# EAGLE schematic batteryless_design_revA (EAGLE 8.5.0)

## Sheet 1 of 2
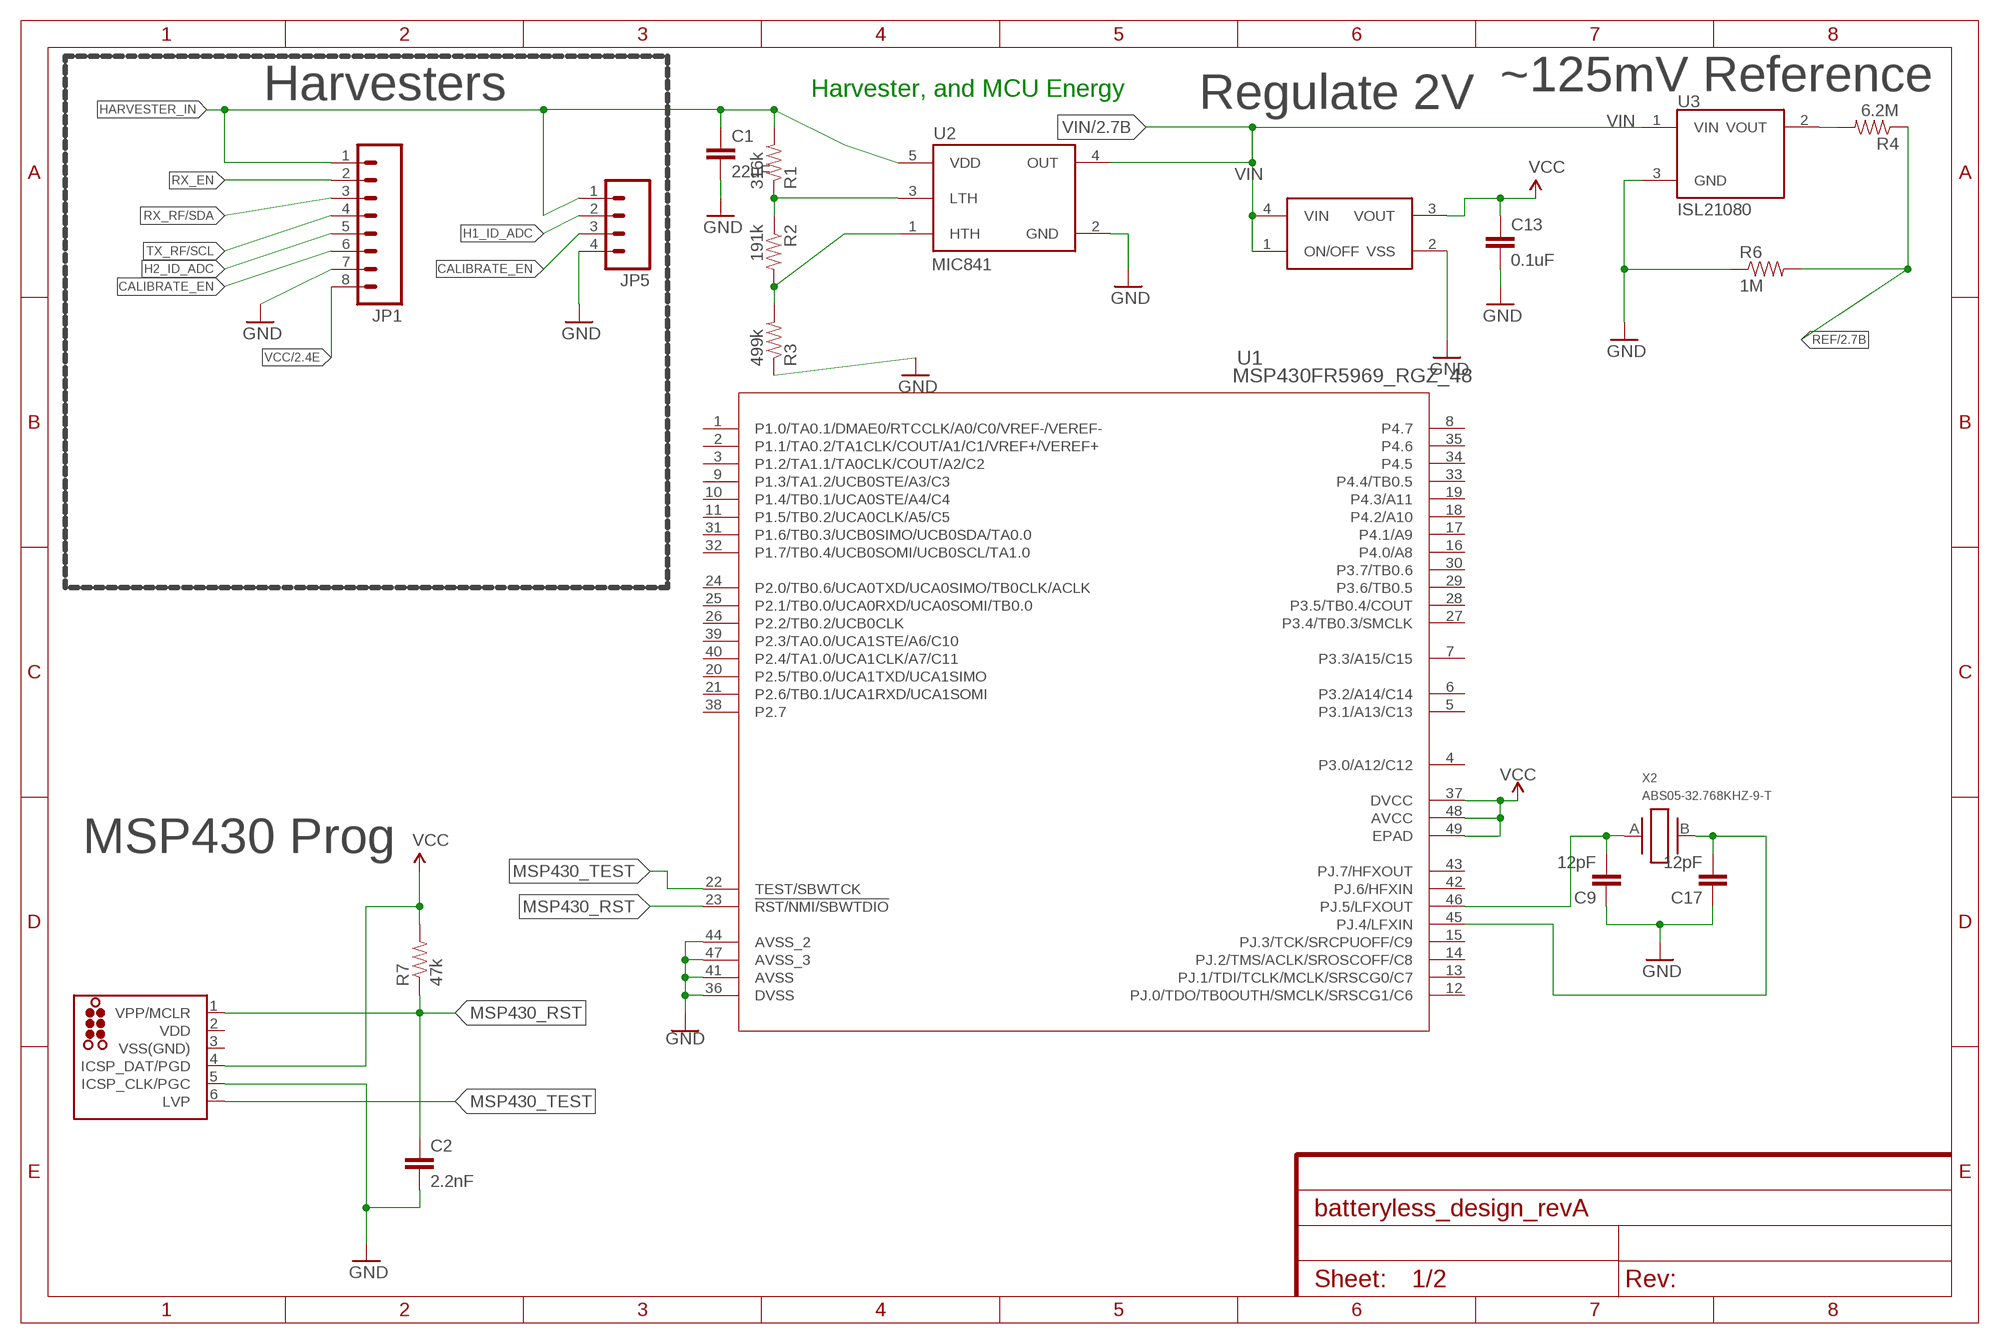
[diagram p0: schematic, sheet 1]

### Parts
C1  22uF  CAP1210  [1210]
C2  2.2nF  C-EU0603  [0603]
C9  12pF  C-EU0603  [0603]
C13  0.1uF  C-EU0603  [0603]
C17  12pF  C-EU0603  [0603]
J1  TC2030-MCP-NL  [TC2030-MCP-NL]
JP1  M081.27MM  [1X08-1.27MM]
JP5  M041.27MM  [1X04-1.27MM]
R1  316k  R-EU0603  [0603]
R2  191k  R-EU0603  [0603]
R3  499k  R-EU0603  [0603]
R4  6.2M  R-EU0603  [0603]
R6  1M  R-EU0603  [0603]
R7  47k  R-EU0603  [0603]
U1  MSP430FR5969_RGZ_48  [RGZ48_4P1X4P1]
U2  MIC841  [SC70-5]
U3  ISL21080  [SOT-23]
U$6  S-1313  [SC82-AB_1PRIMARY]
X2  ABS05-32.768KHZ-9-T  [ABS05]

### Nets
CALIBRATE_EN: JP1.6 JP5.3
GND: C1.2 C2.2 C9.1 C13.2 C17.1 J1.5(ICSP_CLK/PGC) JP1.7 JP5.4 R3.1 R6.1 U1.36(DVSS) U1.41(AVSS) U1.44(AVSS_2) U1.47(AVSS_3) U2.2(GND) U3.3(GND) U$6.2(VSS) ; also sheet 2
H1_ID_ADC: JP5.2
H2_ID_ADC: JP1.5
HARVESTER_IN: C1.1 JP1.1 JP5.1 R1.2 U2.5(VDD)
MSP430_RST: C2.1 J1.1(VPP/MCLR) R7.1
MSP430_TEST: J1.6(LVP)
N$1: U1.22(TEST/SBWTCK)
N$2: U1.23(!RST/NMI/SBWTDIO)
N$3: C17.2 U1.45(PJ.4/LFXIN) X2.B
N$4: C9.2 U1.46(PJ.5/LFXOUT) X2.A
N$5: R1.1 R2.1 U2.3(LTH)
N$6: R2.2 R3.2 U2.1(HTH)
N$7: R4.2 U3.2(VOUT)
REF: R4.1 R6.2 ; also sheet 2
RX_EN: JP1.2
RX_RF/SDA: JP1.3
TX_RF/SCL: JP1.4
VCC: C13.1 J1.4(ICSP_DAT/PGD) JP1.8 R7.2 U1.37(DVCC) U1.48(AVCC) U1.49(EPAD) U$6.3(VOUT) ; also sheet 2
VIN: U2.4(OUT) U3.1(VIN) U$6.1(ON/OFF) U$6.4(VIN) ; also sheet 2
Unconnected: U1.1(P1.0/TA0.1/DMAE0/RTCCLK/A0/C0/VREF-/VEREF-) U1.2(P1.1/TA0.2/TA1CLK/COUT/A1/C1/VREF+/VEREF+) U1.3(P1.2/TA1.1/TA0CLK/COUT/A2/C2) U1.4(P3.0/A12/C12) U1.5(P3.1/A13/C13) U1.6(P3.2/A14/C14) U1.7(P3.3/A15/C15) U1.8(P4.7) U1.9(P1.3/TA1.2/UCB0STE/A3/C3) U1.10(P1.4/TB0.1/UCA0STE/A4/C4) U1.11(P1.5/TB0.2/UCA0CLK/A5/C5) U1.12(PJ.0/TDO/TB0OUTH/SMCLK/SRSCG1/C6) U1.13(PJ.1/TDI/TCLK/MCLK/SRSCG0/C7) U1.14(PJ.2/TMS/ACLK/SROSCOFF/C8) U1.15(PJ.3/TCK/SRCPUOFF/C9) U1.16(P4.0/A8) U1.17(P4.1/A9) U1.18(P4.2/A10) U1.19(P4.3/A11) U1.20(P2.5/TB0.0/UCA1TXD/UCA1SIMO) U1.21(P2.6/TB0.1/UCA1RXD/UCA1SOMI) U1.24(P2.0/TB0.6/UCA0TXD/UCA0SIMO/TB0CLK/ACLK) U1.25(P2.1/TB0.0/UCA0RXD/UCA0SOMI/TB0.0) U1.26(P2.2/TB0.2/UCB0CLK) U1.27(P3.4/TB0.3/SMCLK) U1.28(P3.5/TB0.4/COUT) U1.29(P3.6/TB0.5) U1.30(P3.7/TB0.6) U1.31(P1.6/TB0.3/UCB0SIMO/UCB0SDA/TA0.0) U1.32(P1.7/TB0.4/UCB0SOMI/UCB0SCL/TA1.0) U1.33(P4.4/TB0.5) U1.34(P4.5) U1.35(P4.6) U1.38(P2.7) U1.39(P2.3/TA0.0/UCA1STE/A6/C10) U1.40(P2.4/TA1.0/UCA1CLK/A7/C11) U1.42(PJ.6/HFXIN) U1.43(PJ.7/HFXOUT)

### Notes on the sheet
- Harvesters | Harvester, and MCU Energy | ~125mV Reference
- Regulate 2V
- MSP430 Prog

## Sheet 2 of 2
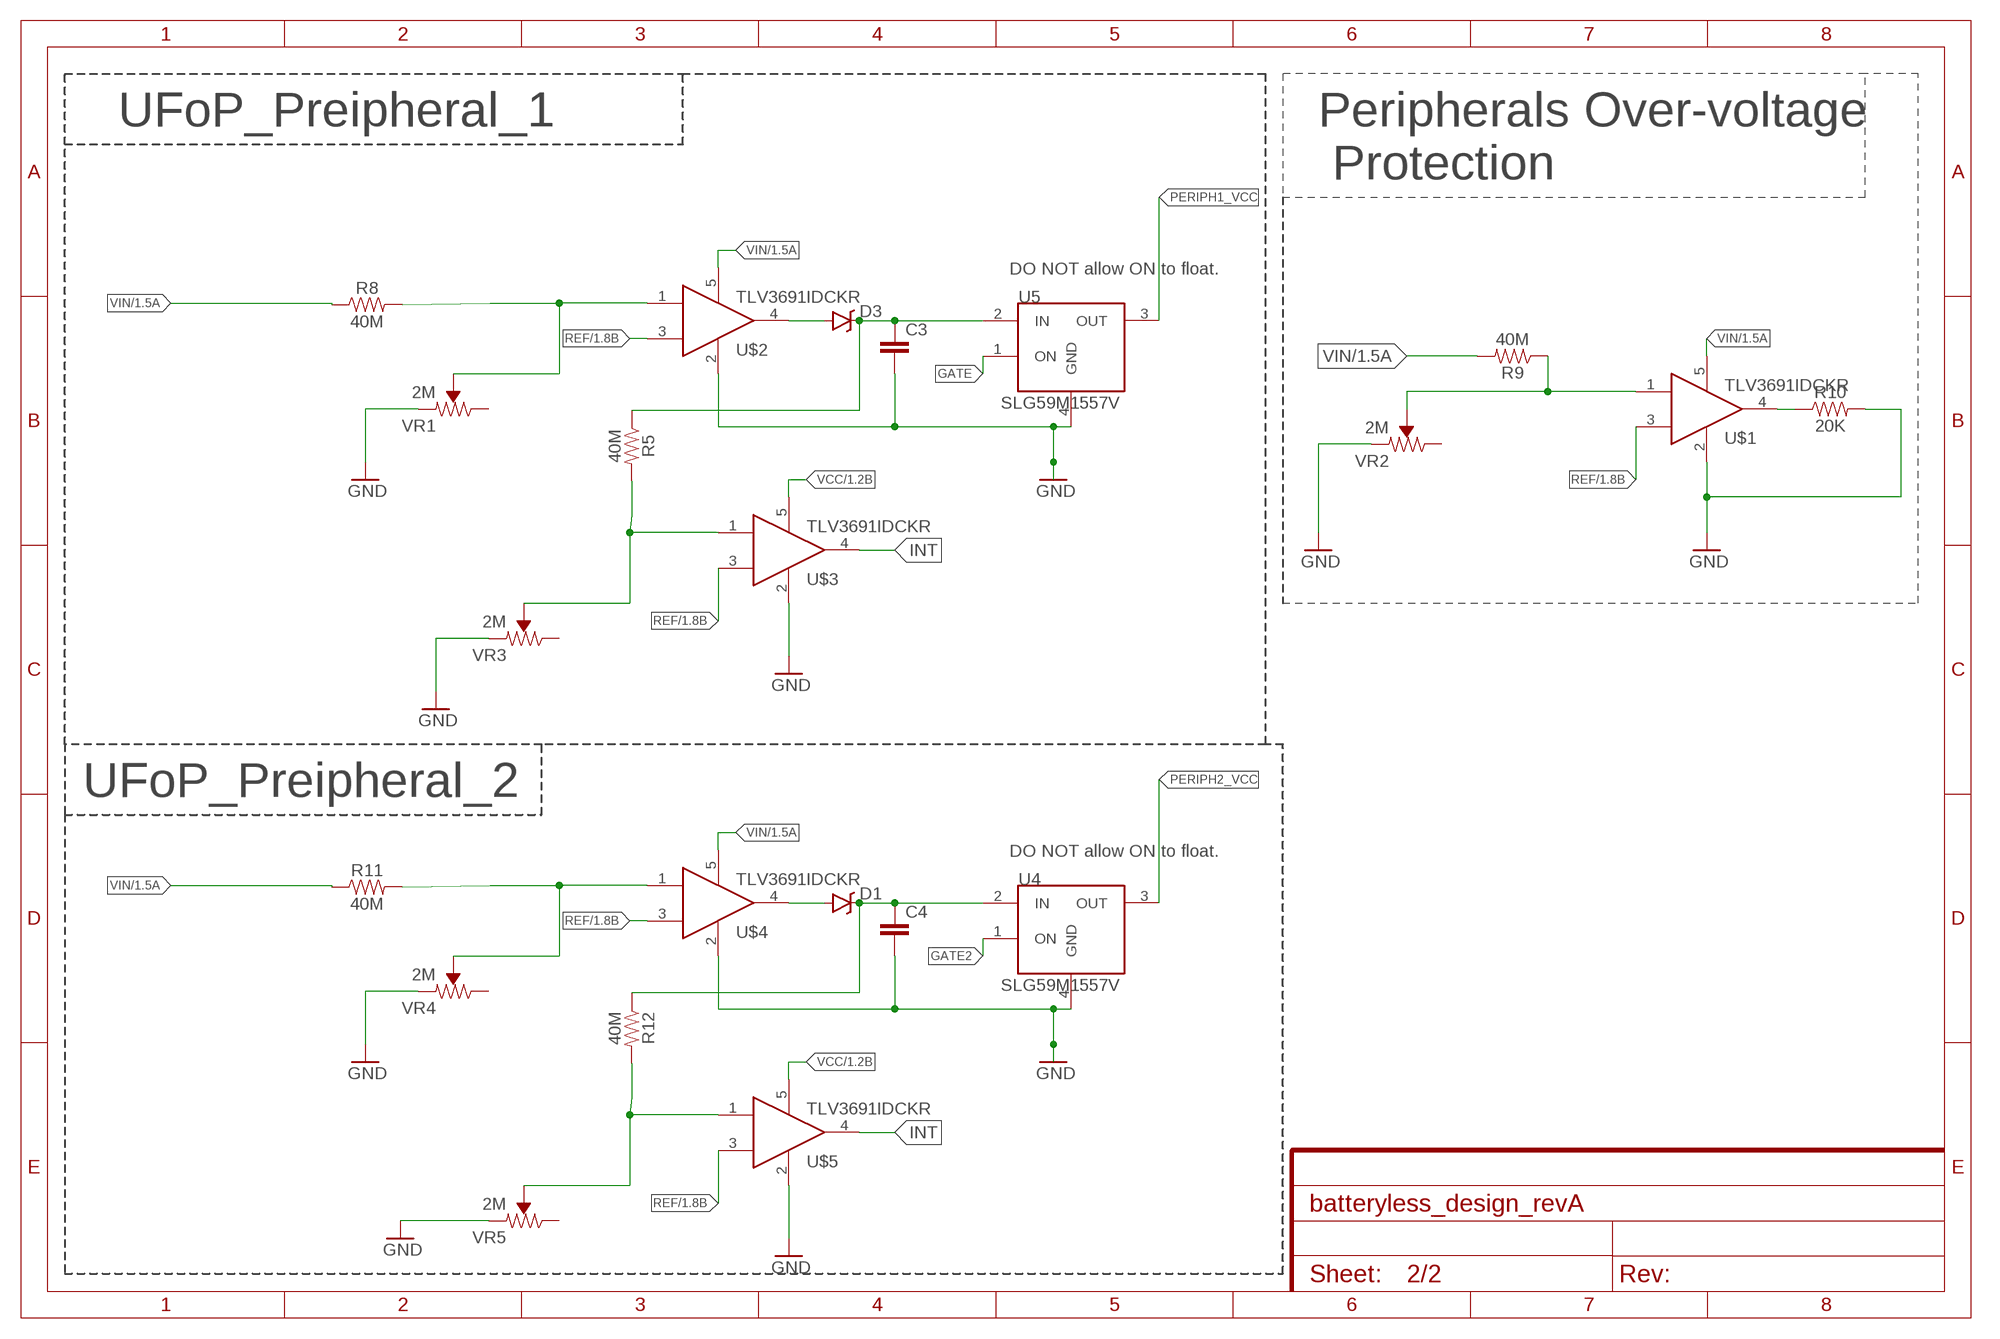
[diagram p1: schematic, sheet 2]

### Parts
C3  0.1UF-0603-25V-(+80/-20%)  [0603]
C4  0.1UF-0603-25V-(+80/-20%)  [0603]
D1  RB751  DIODE-SCHOTTKY-RB751  [SOD-523]
D3  RB751  DIODE-SCHOTTKY-RB751  [SOD-523]
R5  40M  0.3OHM-0805-1/8W-1%  [0805]
R8  40M  0.3OHM-0805-1/8W-1%  [0805]
R9  40M  0.3OHM-0805-1/8W-1%  [0805]
R10  20K  0.3OHM-0805-1/8W-1%  [0805]
R11  40M  0.3OHM-0805-1/8W-1%  [0805]
R12  40M  0.3OHM-0805-1/8W-1%  [0805]
U4  SLG59M1557V  [4STDFN]
U5  SLG59M1557V  [4STDFN]
U$1  TLV3691IDCKR  [SOT353]
U$2  TLV3691IDCKR  [SOT353]
U$3  TLV3691IDCKR  [SOT353]
U$4  TLV3691IDCKR  [SOT353]
U$5  TLV3691IDCKR  [SOT353]
VR1  2M  TRIMPOT-SMD-3MM-CLOSED-1/8W-20%  [TRIMPOT-SMD-3MM-CLOSED]
VR2  2M  TRIMPOT-SMD-3MM-CLOSED-1/8W-20%  [TRIMPOT-SMD-3MM-CLOSED]
VR3  2M  TRIMPOT-SMD-3MM-CLOSED-1/8W-20%  [TRIMPOT-SMD-3MM-CLOSED]
VR4  2M  TRIMPOT-SMD-3MM-CLOSED-1/8W-20%  [TRIMPOT-SMD-3MM-CLOSED]
VR5  2M  TRIMPOT-SMD-3MM-CLOSED-1/8W-20%  [TRIMPOT-SMD-3MM-CLOSED]

### Nets
GATE: U5.1(ON)
GATE2: U4.1(ON)
GND: C3.2 C4.2 R10.2 U4.4(GND) U5.4(GND) U$1.2 U$2.2 U$3.2 U$4.2 U$5.2 VR1.1(CCW) VR2.1(CCW) VR3.1(CCW) VR4.1(CCW) VR5.1(CCW) ; also sheet 1
INT: U$3.4 U$5.4
N$8: R8.2 U$2.1 VR1.2(WIPER)
N$9: D3.A U$2.4
N$10: C3.1 D3.C R5.1 U5.2(IN)
N$11: R9.1 U$1.1 VR2.2(WIPER)
N$12: R10.1 U$1.4
N$13: R5.2 U$3.1 VR3.2(WIPER)
N$14: R11.2 U$4.1 VR4.2(WIPER)
N$15: D1.A U$4.4
N$16: C4.1 D1.C R12.1 U4.2(IN)
N$17: R12.2 U$5.1 VR5.2(WIPER)
PERIPH1_VCC: U5.3(OUT)
PERIPH2_VCC: U4.3(OUT)
REF: U$1.3 U$2.3 U$3.3 U$4.3 U$5.3 ; also sheet 1
VCC: U$3.5 U$5.5 ; also sheet 1
VIN: R8.1 R9.2 R11.1 U$1.5 U$2.5 U$4.5 ; also sheet 1
Unconnected: VR1.3(CW) VR2.3(CW) VR3.3(CW) VR4.3(CW) VR5.3(CW)

### Notes on the sheet
- UFoP_Preipheral_1
- Peripherals Over-voltage
   Protection
- DO NOT allow ON to float.
- UFoP_Preipheral_2
- DO NOT allow ON to float.

## Power pins joined to a net without a drawn wire
VDD: J1.2(VDD)
VSS(GND): J1.3(VSS(GND))

## Library data of the parts
C1 = SparkFun-Capacitors:CAP: Capacitor Standard 0603 ceramic capacitor, and 0.1" leaded capacitor.; MANUFACTURERPARTNUMBER: CL32A226KAJNNNE; MPN: CL32A226KAJNNNE
C2 = tiny_passives:C-EU; MPN: 06035C222KAT2A
C3 C4 = SparkFun-Capacitors:0.1UF: 0.1µF ceramic capacitors A capacitor is a passive two-terminal electrical component used to store electrical energy temporarily in an electric field.; PROD_ID: CAP-00810; VALUE: 0.1uF
C9 C17 = tiny_passives:C-EU; MPN: CL10C120JB8NNNC
C13 = tiny_passives:C-EU; MANUFACTURERPARTNUMBER: 0603YC104KAT2A; MPN: 0603YC104KAT2A
D1 D3 = SparkFun-DiscreteSemi:DIODE-SCHOTTKY: Schottky diodes in SFE's production catalog BAT20J 1A 23V 0.62Vf RB751 120mA 40V 0.37Vf PMEG4005EJ 0.5A 40V 0.42Vf MBRA140 1A 40V 0.5Vf B340A 3A 40V SMA; DIGIKEY: BAS40-02V-V-G-08GICT-ND; MPN: BAS40-02V-V-G-08; PROD_ID: DIO-11018
J1 = tag-connect_msp430:TC2030: TAG-CONNECT ICSP Connector Manufacturer: Tag-Connect <http://www.tag-connect.com> Cable for easy In-Circuit Serial Programming. Designed for Microchip ICD2, suitable for many others. Two variants - one "with legs" (for hands-free fit on PCB) and another "without legs" for quick programming. PAD Description 1 MCLR/Vpp 2 Vdd 3 GND 4 PGD (ISPDAT) 5 PGC (ISPCLK) 6 nc (used for LVP) ©2009 ROFA.cz - modified and updated by Robert Darlington ‹rdarlington@gmail.com›
JP1 = SparkFun-Connectors:M08: Header 8 Standard 8-pin 0.1" header. Use with straight break away headers (SKU : PRT-00116), right angle break away headers (PRT-00553), swiss pins (PRT-00743), machine pins (PRT-00117), and female headers (PRT-00115).; DIGIKEY: ED90570-ND; MANUFACTURERPARTNUMBER: 851-43-008-10-001000; MPN: 851-43-008-10-001000
JP5 = SparkFun-Connectors:M04: Header 4 Standard 4-pin 0.1" header. Use with straight break away headers (SKU : PRT-00116), right angle break away headers (PRT-00553), swiss pins (PRT-00743), machine pins (PRT-00117), and female headers (PRT-00115). Molex polarized connector foot print use with SKU : PRT-08231 with associated crimp pins and housings. 1MM SMD Version SKU: PRT-10208; DIGIKEY: ED90528-ND; MANUFACTURERPARTNUMBER: 851-43-004-10-001000; MPN: 851-43-004-10-001000
R1 = tiny_passives:R-EU; DIGIKEY: 311-316KHRCT-ND; MANUFACTURERPARTNUMBER: RC0603FR-07316KL; MPN: RC0603FR-07316KL
R2 = tiny_passives:R-EU; DIGIKEY: 311-191KHRCT-ND; MANUFACTURERPARTNUMBER: RC0603FR-07191KL; MPN: RC0603FR-07191KL
R3 = tiny_passives:R-EU; DIGIKEY: 311-499KHRCT-ND; MANUFACTURERPARTNUMBER: RC0603FR-07499KL; MPN: RC0603FR-07499KL
R4 = tiny_passives:R-EU; DIGIKEY: 541-6.20MHCT-ND; MPN: CRCW06036M20FKEA
R5 R8-R12 = SparkFun-Resistors:0.3OHM: 0.3Ω resistor A resistor is a passive two-terminal electrical component that implements electrical resistance as a circuit element. Resistors act to reduce current flow, and, at the same time, act to lower voltage levels within circuits. - Wikipedia; PROD_ID: RES-11622; VALUE: 0.3
R6 = tiny_passives:R-EU; DIGIKEY: 311-1.00MHRCT-ND; MPN: RC0603FR-071ML
R7 = tiny_passives:R-EU; MPN: CRCW060347K0JNEA
U1 = Arwa_lib:MSP430FR5969_RGZ_48; MANUFACTURER_PART_NUMBER: msp430fr5969_rgz_48; VENDOR: Texas Instruments
U2 = fedpower:MIC841: MIC841:Comparator with reference and adj. hysteresis; DIGIKEY: 576-2923-1-ND; MPN: MIC841HYC5-TR
U3 = isl21080:ISL21080: Intersil: ISL21080, 300nA NanoPower Voltage References The ISL21080 analog voltage references feature low supply voltage operation at ultra-low 310nA typ, 1.5µA max operating current. Additionally, the ISL21080 family features guaranteed initial accuracy as low as ±0.2% and 50ppm/°C temperature coefficient. These references are ideal for general purpose portable applications to extend battery life at lower cost. The ISL21080 is provided in the industry standard 3 Ld SOT-23 pinout. The ISL21080 output voltages can be used as precision voltage sources for voltage monitors, control loops, standby voltages for low power states for DSP, FPGA, Datapath Controllers, microcontrollers and other core voltages: 0.9V, 1.024V, 1.25V, 1.5V, 2.048V, 2.5V, 3.0V, 3.3V, 4.096V and 5.0V. Special Note: Post-assembly x-ray inspection may lead to permanent changes in device output voltage and should be minimized or avoided. For further information, please see “Applications Information” on page 14 and AN1533, “X-Ray Effects on Intersil FGA References”.; DIGIKEY: ISL21080DIH309Z-TKCT-ND; MPN: ISL21080DIH309Z-TK
U4 U5 = loadswitches:SLG59M1557V: SILEGO SLG59M1557V: Ultra-small 28.5 mΩ, 1.0 A Integrated Power Switch with Discharge The SLG59M1557V is designed for load switching applications with ultra low quiescent current (20nA), and low turn on voltage (0.85V). The part comes with one 28.5 mΩ 1.0 A rated P-channel MOSFET controlled by a single ON control pin. The product is packaged in an ultra-small 1.0 x 1.0 mm package.; MANAFACTURER: SLG59M1557V; MOUSER: 402-SLG59M1557V; MPN: SLG59M1557V
U$1-U$5 = Arwa_lib:TLV3691IDCKR
U$6 = Arwa_lib:S-1313
VR1-VR5 = SparkFun-Resistors:TRIMPOT: Trimming Potentiometer (Trimpot) Three-terminal potentiometers, with an adjustable wiper and two adjustable resistors. A pot can be used to create a configurable voltage divider, or as a variable resistor. "Trimpots" are a subset of potentiometers, usually intended for "set-and-forget" applications. They're often more delicate than standard potentiometers - rated for fewer turns. Variants PTH-KNOB - PTH Trimpot w/ finger-adjustable knob Trimpot 10K with Knob <https://www.sparkfun.com/products/9806> (COM-09806) Datasheet <http://www.sparkfun.com/datasheets/Components/General/TSR-3386.pdf> SMD-3MM-CLOSED-FRAME - SMD 3mm Square Closed-Frame Trimpot Used on e.g. EasyDriver - Stepper Motor Driver <https://www.sparkfun.com/products/12779> Datasheet <http://www.bitechnologies.com/pdfs/22.pdf> (22AR10KTR) SMD-5MM - SMD 5mm Square Closed-Frame Trimpot Used on e.g. IOIO-OTG - V2.2 <https://www.sparkfun.com/products/13613> Datasheet <http://www.vishay.com/docs/51008/ts53.pdf> (TS53YL502MR10) SMD-3MM-1/10W-25% - 3mm Square Open-Frame Trimpot Used on e.g. SparkFun Shapeoko <https://www.sparkfun.com/products/13899> Datasheet <http://www.bourns.com/docs/Product-Datasheets/TC33.pdf> (TC33X-2-103E); PROD_ID: RES-09285; VALUE: 10k
X2 = abs05:ABS05-32.768KHZ: 32.768kHz Crystal; DIGIKEY: 535-11897-1-ND; MPN: ABS05-32.768KHZ-9-T